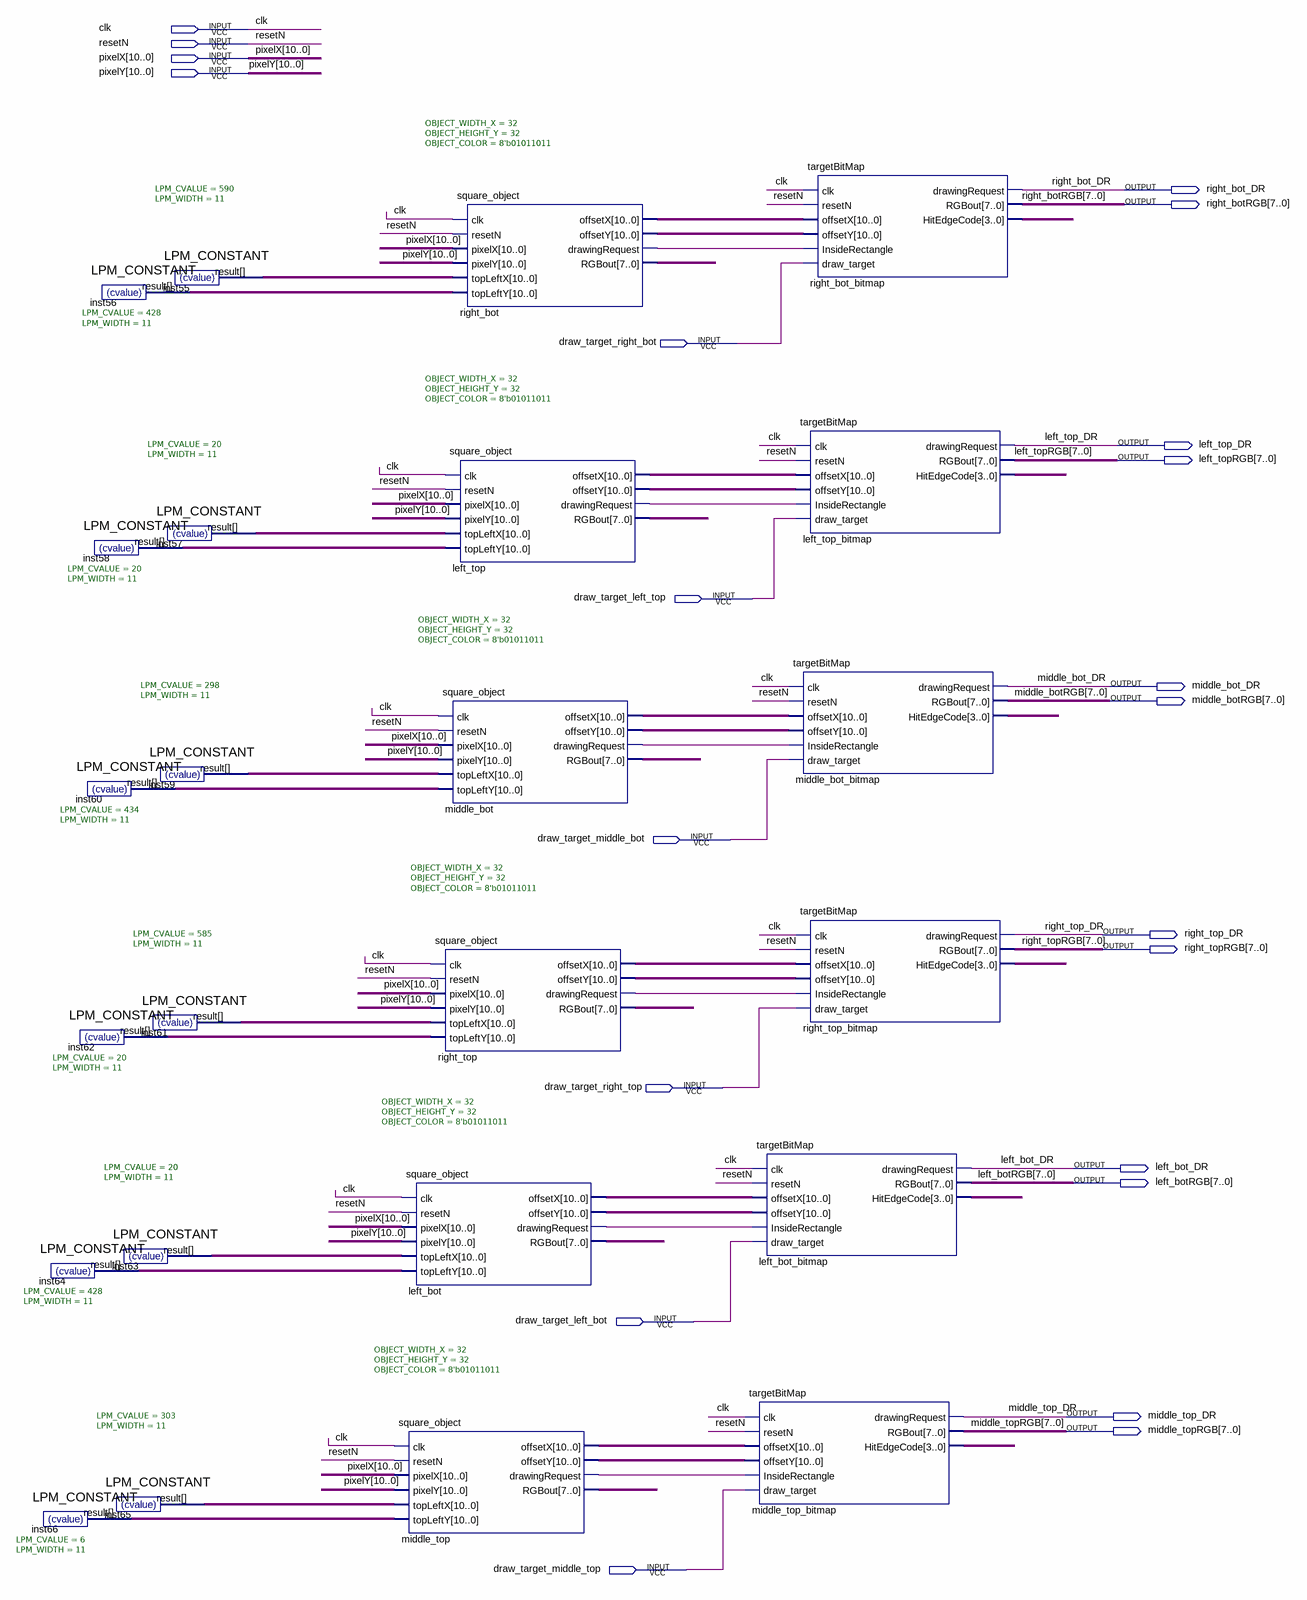
[diagram p0: schematic sheet]
// Quartus schematic target_block.bdf as structural Verilog: 24 symbols, 22 pins
module target_block (
  input  clk,
  input  resetN,
  input  [10:0] pixelX,
  input  [10:0] pixelY,
  input  draw_target_right_bot,
  input  draw_target_left_top,
  input  draw_target_middle_bot,
  input  draw_target_right_top,
  input  draw_target_left_bot,
  input  draw_target_middle_top,
  output right_bot_DR,
  output [7:0] right_botRGB,
  output left_top_DR,
  output [7:0] left_topRGB,
  output middle_bot_DR,
  output [7:0] middle_botRGB,
  output right_top_DR,
  output [7:0] right_topRGB,
  output left_bot_DR,
  output [7:0] left_botRGB,
  output middle_top_DR,
  output [7:0] middle_topRGB
);

  wire left_bot_drawingrequest, left_top_drawingrequest, middle_bot_drawingrequest,
       middle_top_drawingrequest, right_bot_drawingrequest, right_top_drawingrequest;
  wire [3:0] left_bot_bitmap_hitedgecode, left_top_bitmap_hitedgecode, middle_bot_bitmap_hitedgecode,
       middle_top_bitmap_hitedgecode, right_bot_bitmap_hitedgecode, right_top_bitmap_hitedgecode;
  wire [7:0] left_bot_rgbout, left_top_rgbout, middle_bot_rgbout, middle_top_rgbout, right_bot_rgbout,
       right_top_rgbout;
  wire [10:0] inst55_result, inst56_result, inst57_result, inst58_result, inst59_result, inst60_result,
       inst61_result, inst62_result, inst63_result, inst64_result, inst65_result, inst66_result,
       left_bot_offsetx, left_bot_offsety, left_top_offsetx, left_top_offsety, middle_bot_offsetx,
       middle_bot_offsety, middle_top_offsetx, middle_top_offsety, right_bot_offsetx, right_bot_offsety,
       right_top_offsetx, right_top_offsety;

  LPM_CONSTANT #(.LPM_CVALUE(20), .LPM_WIDTH(11)) inst62 (.result(inst62_result));
  LPM_CONSTANT #(.LPM_CVALUE(428), .LPM_WIDTH(11)) inst64 (.result(inst64_result));
  LPM_CONSTANT #(.LPM_CVALUE(6), .LPM_WIDTH(11)) inst66 (.result(inst66_result));
  LPM_CONSTANT #(.LPM_CVALUE(428), .LPM_WIDTH(11)) inst56 (.result(inst56_result));
  LPM_CONSTANT #(.LPM_CVALUE(20), .LPM_WIDTH(11)) inst58 (.result(inst58_result));
  LPM_CONSTANT #(.LPM_CVALUE(434), .LPM_WIDTH(11)) inst60 (.result(inst60_result));
  LPM_CONSTANT #(.LPM_CVALUE(20), .LPM_WIDTH(11)) inst63 (.result(inst63_result));
  LPM_CONSTANT #(.LPM_CVALUE(303), .LPM_WIDTH(11)) inst65 (.result(inst65_result));
  LPM_CONSTANT #(.LPM_CVALUE(590), .LPM_WIDTH(11)) inst55 (.result(inst55_result));
  LPM_CONSTANT #(.LPM_CVALUE(20), .LPM_WIDTH(11)) inst57 (.result(inst57_result));
  LPM_CONSTANT #(.LPM_CVALUE(298), .LPM_WIDTH(11)) inst59 (.result(inst59_result));
  LPM_CONSTANT #(.LPM_CVALUE(585), .LPM_WIDTH(11)) inst61 (.result(inst61_result));
  square_object #(.OBJECT_WIDTH_X(32), .OBJECT_HEIGHT_Y(32), .OBJECT_COLOR(8'b01011011)) left_bot (
    .clk(clk), .resetN(resetN), .pixelX(pixelX), .pixelY(pixelY), .topLeftX(inst63_result),
    .topLeftY(inst64_result), .offsetX(left_bot_offsetx), .offsetY(left_bot_offsety),
    .drawingRequest(left_bot_drawingrequest), .RGBout(left_bot_rgbout));
  square_object #(.OBJECT_WIDTH_X(32), .OBJECT_HEIGHT_Y(32), .OBJECT_COLOR(8'b01011011)) middle_top (
    .clk(clk), .resetN(resetN), .pixelX(pixelX), .pixelY(pixelY), .topLeftX(inst65_result),
    .topLeftY(inst66_result), .offsetX(middle_top_offsetx), .offsetY(middle_top_offsety),
    .drawingRequest(middle_top_drawingrequest), .RGBout(middle_top_rgbout));
  square_object #(.OBJECT_WIDTH_X(32), .OBJECT_HEIGHT_Y(32), .OBJECT_COLOR(8'b01011011)) right_bot (
    .clk(clk), .resetN(resetN), .pixelX(pixelX), .pixelY(pixelY), .topLeftX(inst55_result),
    .topLeftY(inst56_result), .offsetX(right_bot_offsetx), .offsetY(right_bot_offsety),
    .drawingRequest(right_bot_drawingrequest), .RGBout(right_bot_rgbout));
  square_object #(.OBJECT_WIDTH_X(32), .OBJECT_HEIGHT_Y(32), .OBJECT_COLOR(8'b01011011)) left_top (
    .clk(clk), .resetN(resetN), .pixelX(pixelX), .pixelY(pixelY), .topLeftX(inst57_result),
    .topLeftY(inst58_result), .offsetX(left_top_offsetx), .offsetY(left_top_offsety),
    .drawingRequest(left_top_drawingrequest), .RGBout(left_top_rgbout));
  square_object #(.OBJECT_WIDTH_X(32), .OBJECT_HEIGHT_Y(32), .OBJECT_COLOR(8'b01011011)) middle_bot (
    .clk(clk), .resetN(resetN), .pixelX(pixelX), .pixelY(pixelY), .topLeftX(inst59_result),
    .topLeftY(inst60_result), .offsetX(middle_bot_offsetx), .offsetY(middle_bot_offsety),
    .drawingRequest(middle_bot_drawingrequest), .RGBout(middle_bot_rgbout));
  square_object #(.OBJECT_WIDTH_X(32), .OBJECT_HEIGHT_Y(32), .OBJECT_COLOR(8'b01011011)) right_top (
    .clk(clk), .resetN(resetN), .pixelX(pixelX), .pixelY(pixelY), .topLeftX(inst61_result),
    .topLeftY(inst62_result), .offsetX(right_top_offsetx), .offsetY(right_top_offsety),
    .drawingRequest(right_top_drawingrequest), .RGBout(right_top_rgbout));
  targetBitMap left_bot_bitmap (
    .clk(clk), .resetN(resetN), .offsetX(left_bot_offsetx), .offsetY(left_bot_offsety),
    .InsideRectangle(left_bot_drawingrequest), .draw_target(draw_target_left_bot),
    .drawingRequest(left_bot_DR), .RGBout(left_botRGB), .HitEdgeCode(left_bot_bitmap_hitedgecode));
  targetBitMap middle_top_bitmap (
    .clk(clk), .resetN(resetN), .offsetX(middle_top_offsetx), .offsetY(middle_top_offsety),
    .InsideRectangle(middle_top_drawingrequest), .draw_target(draw_target_middle_top),
    .drawingRequest(middle_top_DR), .RGBout(middle_topRGB), .HitEdgeCode(middle_top_bitmap_hitedgecode));
  targetBitMap right_bot_bitmap (
    .clk(clk), .resetN(resetN), .offsetX(right_bot_offsetx), .offsetY(right_bot_offsety),
    .InsideRectangle(right_bot_drawingrequest), .draw_target(draw_target_right_bot),
    .drawingRequest(right_bot_DR), .RGBout(right_botRGB), .HitEdgeCode(right_bot_bitmap_hitedgecode));
  targetBitMap left_top_bitmap (
    .clk(clk), .resetN(resetN), .offsetX(left_top_offsetx), .offsetY(left_top_offsety),
    .InsideRectangle(left_top_drawingrequest), .draw_target(draw_target_left_top),
    .drawingRequest(left_top_DR), .RGBout(left_topRGB), .HitEdgeCode(left_top_bitmap_hitedgecode));
  targetBitMap middle_bot_bitmap (
    .clk(clk), .resetN(resetN), .offsetX(middle_bot_offsetx), .offsetY(middle_bot_offsety),
    .InsideRectangle(middle_bot_drawingrequest), .draw_target(draw_target_middle_bot),
    .drawingRequest(middle_bot_DR), .RGBout(middle_botRGB), .HitEdgeCode(middle_bot_bitmap_hitedgecode));
  targetBitMap right_top_bitmap (
    .clk(clk), .resetN(resetN), .offsetX(right_top_offsetx), .offsetY(right_top_offsety),
    .InsideRectangle(right_top_drawingrequest), .draw_target(draw_target_right_top),
    .drawingRequest(right_top_DR), .RGBout(right_topRGB), .HitEdgeCode(right_top_bitmap_hitedgecode));
endmodule
